# EAGLE design esp8266-3cell (EAGLE 8.5.2)
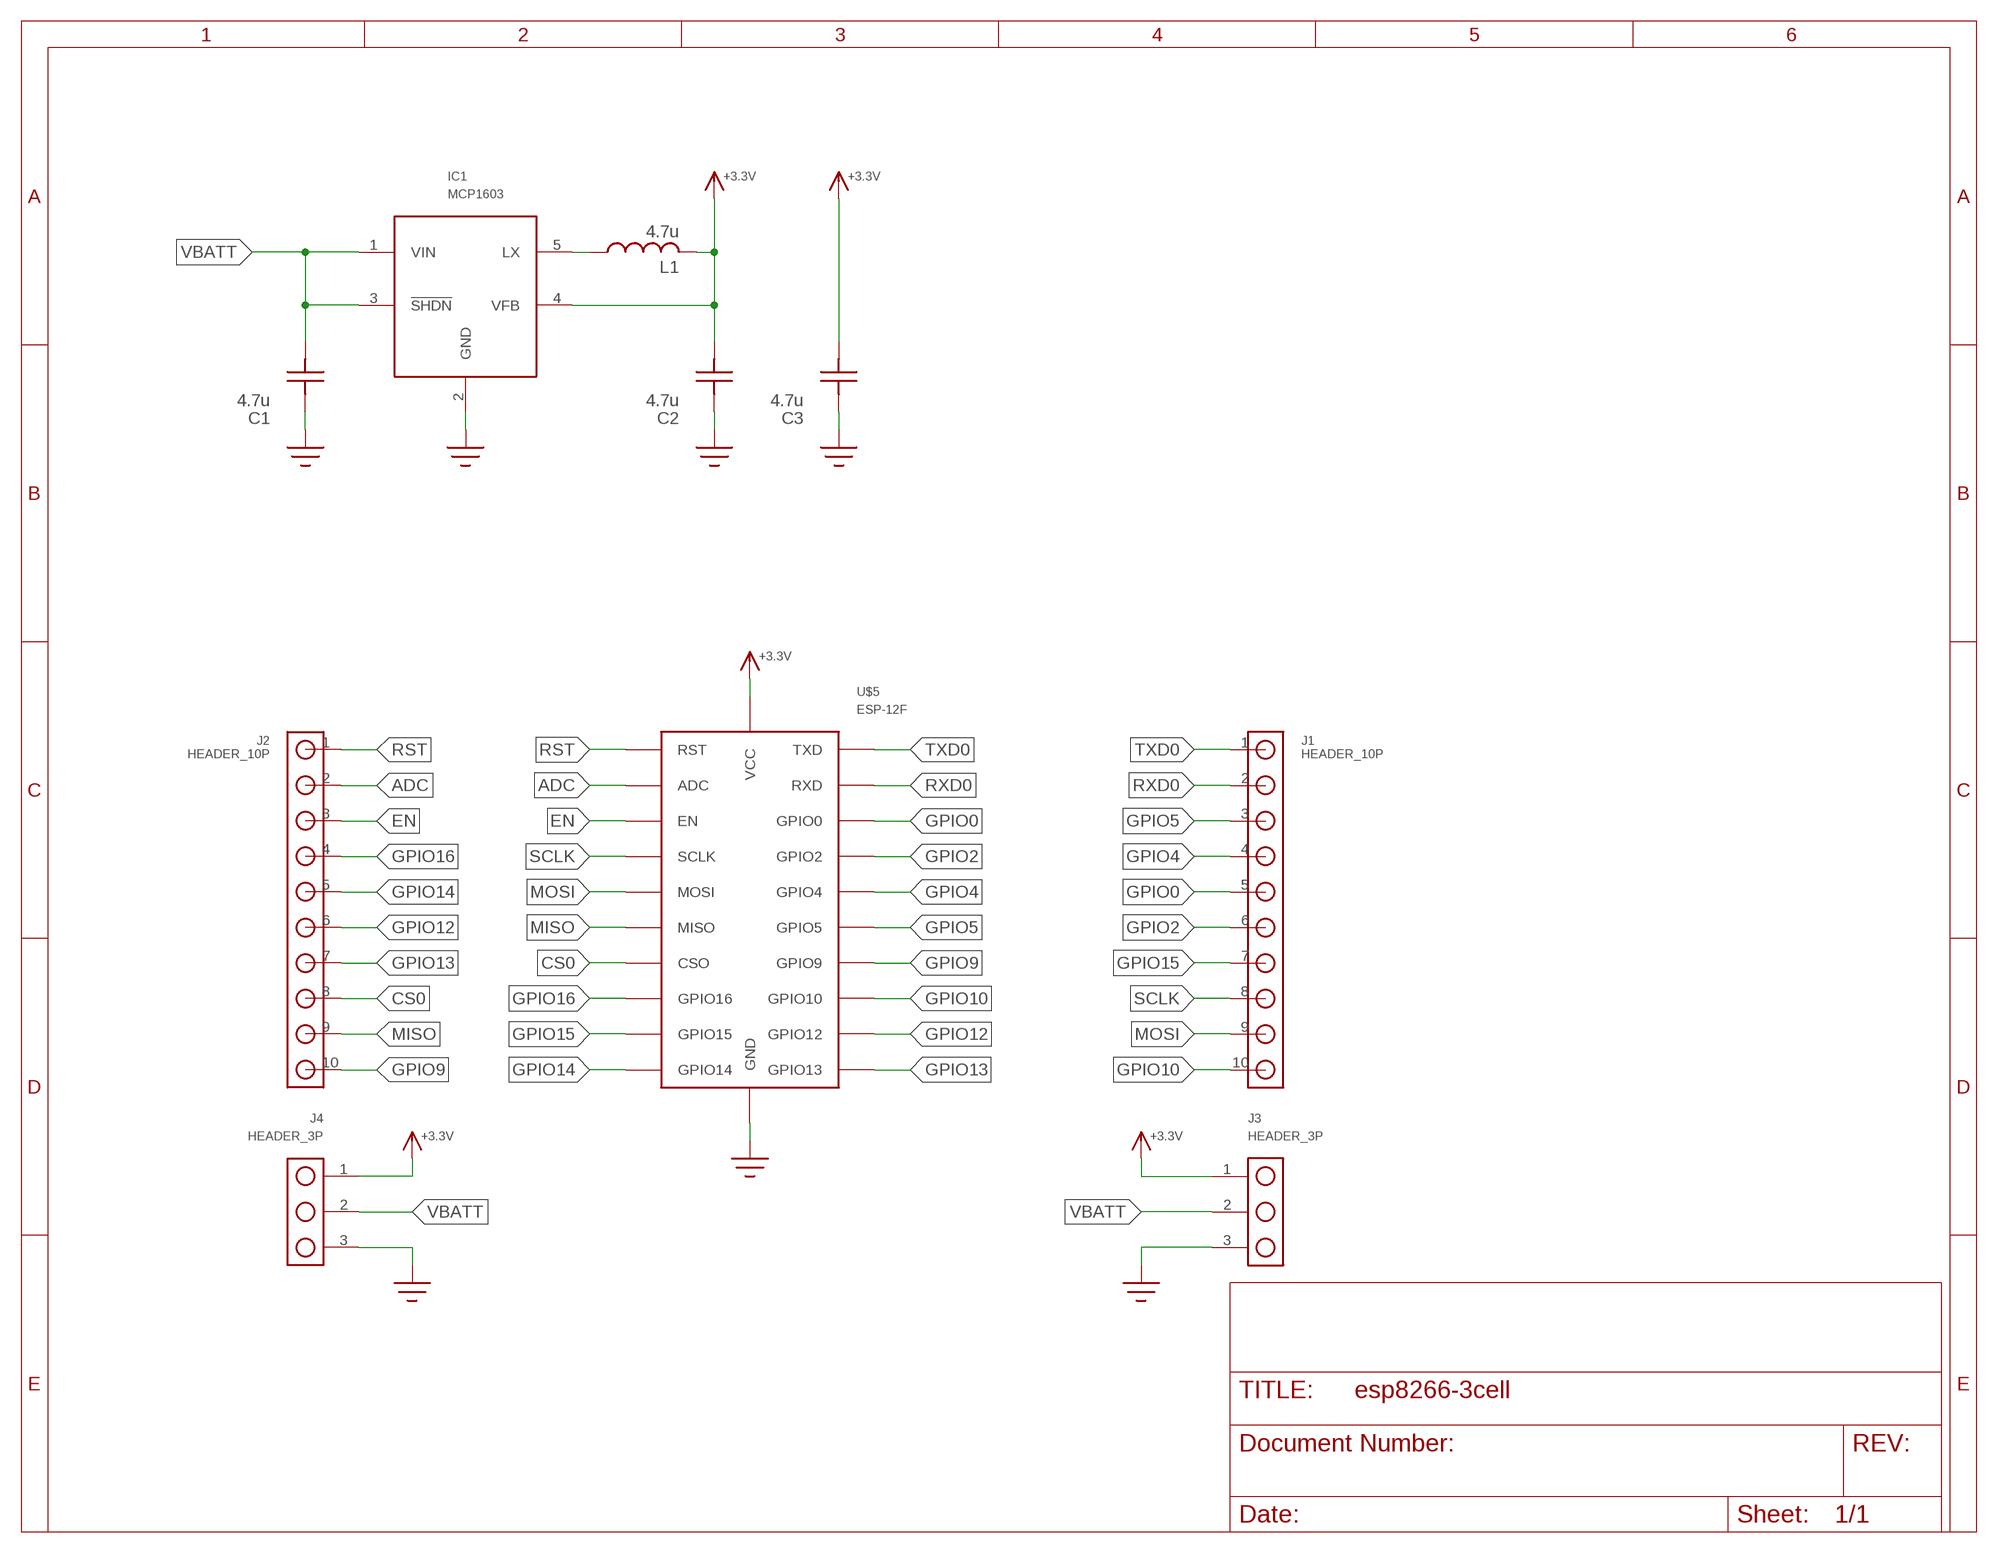
[diagram p0: schematic, sheet 1]

## Parts
C1  4.7u  C0805  [0805]
C2  4.7u  C0805  [0805]
C3  4.7u  C0805  [0805]
IC1  MCP1603  [SOT23-5]
J1  HEADER_10P  [HEADER_10P]
J2  HEADER_10P  [HEADER_10P]
J3  HEADER_3P  [HEADER_3P]
J4  HEADER_3P  [HEADER_3P]
L1  4.7u  L  [L24X24]
U$5  ESP-12F  [ESP-12F]

## Nets
+3.3V: C2.P$1 C3.P$1 IC1.4(VFB) J3.1 J4.1 L1.2 U$5.VCC
ADC: J2.2 U$5.ADC
CS0: J2.8 U$5.CSO
EN: J2.3 U$5.EN
GND: C1.P$2 C2.P$2 C3.P$2 IC1.2(GND) J3.3 J4.3 U$5.GND
GPIO0: J1.5 U$5.GPIO0
GPIO2: J1.6 U$5.GPIO2
GPIO4: J1.4 U$5.GPIO4
GPIO5: J1.3 U$5.GPIO5
GPIO9: J2.10 U$5.GPIO9
GPIO10: J1.10 U$5.GPIO10
GPIO12: J2.6 U$5.GPIO12
GPIO13: J2.7 U$5.GPIO13
GPIO14: J2.5 U$5.GPIO14
GPIO15: J1.7 U$5.GPIO15
GPIO16: J2.4 U$5.GPIO16
MISO: J2.9 U$5.MISO
MOSI: J1.9 U$5.MOSI
N$2: IC1.5(LX) L1.1
RST: J2.1 U$5.RST
RXD0: J1.2 U$5.RXD
SCLK: J1.8 U$5.SCLK
TXD0: J1.1 U$5.TXD
VBATT: C1.P$1 IC1.1(VIN) IC1.3(!SHDN!) J3.2 J4.2

## Library data of the parts
C1-C3 = esp8266-3cell:C
IC1 = esp8266-3cell:MCP1603
J1 J2 = esp8266-3cell:HEADER_10P
J3 J4 = esp8266-3cell:HEADER_3P
L1 = esp8266-3cell:L
U$5 = esp8266-3cell:ESP-12F

## Board
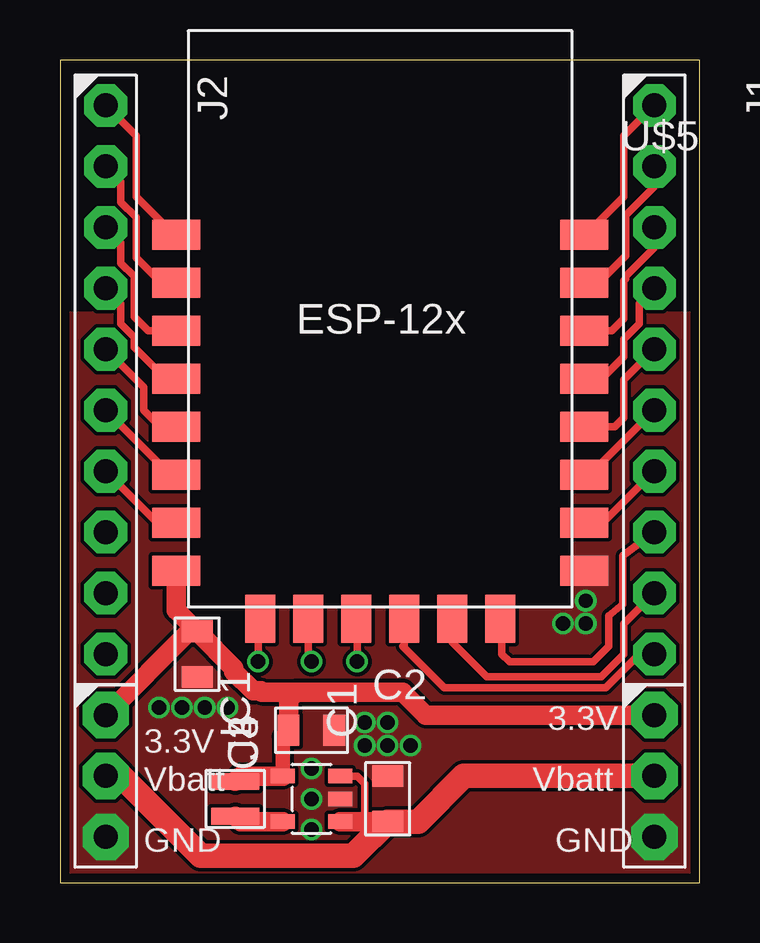
[diagram p1: board, top side]
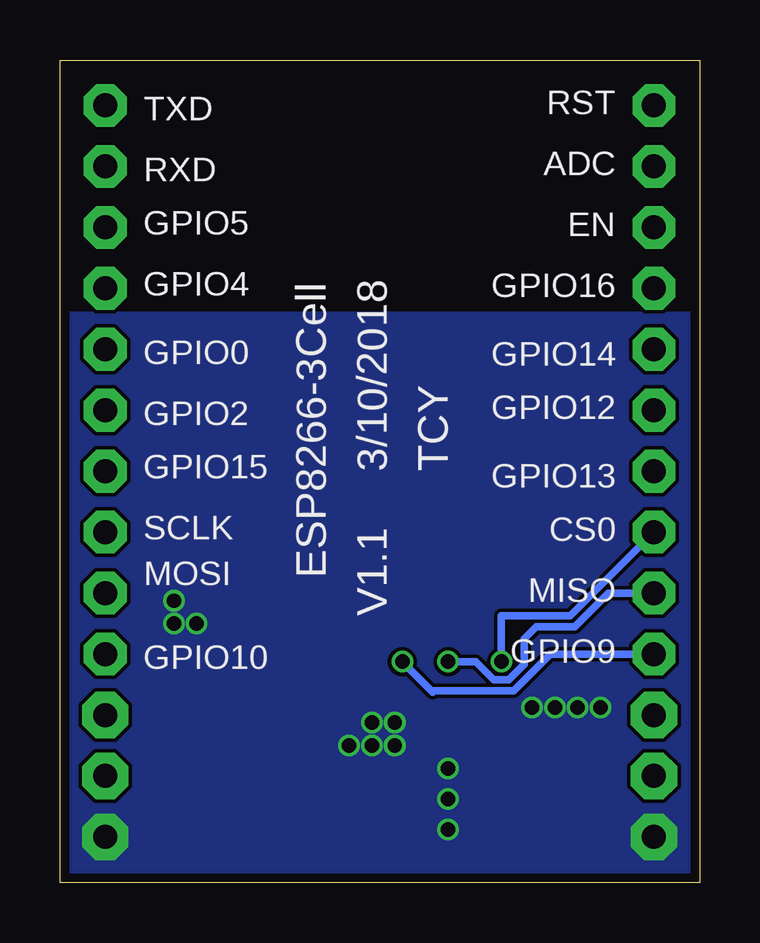
[diagram p2: board, bottom side, seen from below]

Size 26.65 x 34.28 mm. Coordinates in mm from the lower left corner, seen from the top.
Outline: 0,0 26.65,0 26.65,34.28 0,34.28 0,0
Copper layers (1*16): Top 0.035559375mm / dielectric 1.6mm / Bottom 0.035559375mm
Design rules "oshpark-2layer": minimum track width 6mil, minimum drill 10mil, track to track 6mil, track to pad 6mil, pad to pad 6mil, via to via 6mil, smd to smd 6mil, copper to edge 15mil, drill to drill 6mil, minimum pad ring 5mil, minimum via ring 5mil, stop-mask expansion 2.5mil, vias tented up to drill 0mil, thermal gap 10mil
tRestrict: area 5.4,11.4 to 21.3,27.6; area 0,23.8 to 26.7,34.3
bRestrict: area 0,23.8 to 26.7,34.3

### Footprints (pad centres in the part's own frame; a part is rotated, then mirrored left to right if it is on the bottom)
0805 = smd 0.9 x 1.3: P$1 -0.95,0; P$2 0.95,0
SOT23-5 = smd 0.6 x 1: 1 -0.95,-1.2; 2 0,-1.2; 3 0.95,-1.2; 4 0.95,1.2; 5 -0.95,1.2
HEADER_10P = drill 1 pad 1.778 octagon: 1 -11.43,0; 2 -8.89,0; 3 -6.35,0; 4 -3.81,0; 5 -1.27,0; 6 1.27,0; 7 3.81,0; 8 6.35,0; 9 8.89,0; 10 11.43,0
HEADER_3P = drill 1 pad 1.93 octagon: 1 -2.54,0; 2 0,0; 3 2.54,0
L24X24 = smd 0.7 x 2: 1 -0.725,0; 2 0.725,0
ESP-12F = smd 2 x 1.25: ADC -8.5,1.5; EN -8.5,-0.5; GND 8.5,-10.5; GPIO0 8.5,-4.5; GPIO2 8.5,-6.5; GPIO4 8.5,-2.5; GPIO5 8.5,-0.5; GPIO12 -8.5,-6.5; GPIO13 -8.5,-8.5; GPIO14 -8.5,-4.5; GPIO15 8.5,-8.5; GPIO16 -8.5,-2.5; RST -8.5,3.5; RXD 8.5,1.5; TXD 8.5,3.5; VCC -8.5,-10.5 | smd 1.25 x 2: CSO -5,-12.5; GPIO9 -1,-12.5; GPIO10 1,-12.5; MISO -3,-12.5; MOSI 3,-12.5; SCLK 5,-12.5

### Placement (x,y rotation side)
C1  13.65,3.49 90 top
C2  10.48,6.35 0 top
C3  5.71,9.53 270 top
IC1  10.48,3.49 90 top
J1  24.77,20.95 270 top
J2  1.91,20.95 270 top
J3  24.77,4.45 270 top
J4  1.91,4.45 270 top
L1  7.3,3.49 90 top
U$5  13.34,23.5 0 top

### Tracks (layer width: path | path; a pad name or v marks a point on that pad's centre or on a via)
+3.3V
  Top 0.61: C2.P$1 9.28,6.1 IC1.4
  Top 0.813: 9.84,7.94 14.29,7.94 15.24,6.99 J3.1 | 9.84,7.94 9.53,7.62 C2.P$1 | C3.P$1 7.25,8.94 7.25,8.79 8.04,7.99 8.36,7.99 8.41,7.94 9.84,7.94 | C3.P$1 4.83,11.36 U$5.VCC | J4.1 5.39,10.47 C3.P$1 | IC1.4 7.53,4.44 L1.2
ADC
  Top 0.305: J2.2 2.54,29.21 2.54,28.36 3.17,27.72 3.17,26.04 4.21,25 U$5.ADC
CS0  (via drill 0.6)
  Top 0.305: U$5.CSO 8.26,10.91 v8.26,9.21
  Bottom 0.305: J2.8 5.4,11.11 8.26,11.11 v8.26,9.21
EN
  Top 0.305: J2.3 2.54,26.67 2.54,25.82 3.1,25.26 3.1,23.57 3.67,23 U$5.EN
GND  (via drill 0.6)
  other vias: 5.08,7.3 6.03,7.3 12.7,5.71 12.7,6.67 6.99,7.3 4.13,7.3 13.65,5.71 13.65,6.67 14.61,5.71 21.91,11.75 21.91,10.79 20.95,10.79 10.48,3.49 10.48,4.76 10.48,2.22
  pour Top (rank 2, no thermals): 26.67,0 26.67,34.29 0,34.29 0,0
  pour Bottom (no thermals): 0,0 26.67,0 26.67,34.29 0,34.29
GPIO0
  Top 0.305: J1.5 23.5,20.95 23.5,19.37 23.12,19 U$5.GPIO0
GPIO2
  Top 0.305: J1.6 22.07,17 U$5.GPIO2
GPIO4
  Top 0.305: J1.4 24.13,24.13 24.13,23.28 23.5,22.64 23.5,21.91 22.58,21 U$5.GPIO4
GPIO5
  Top 0.305: J1.3 24.77,26.45 23.57,25.26 23.57,25.16 23.5,25.08 23.5,23.5 23,23 U$5.GPIO5
GPIO9  (via drill 0.6)
  Top 0.305: v12.38,9.21 12.38,10.95 U$5.GPIO9
  Bottom 0.305: v12.38,9.21 11.11,7.94 11.05,8 7.75,8 6.22,9.53 J2.10
GPIO10
  Top 0.305: J1.10 24.14,9.53 22.73,8.12 16.02,8.12 14.29,9.84 14.34,9.89 U$5.GPIO10
GPIO12
  Top 0.305: J2.6 4.59,17 U$5.GPIO12
GPIO13
  Top 0.305: J2.7 4.05,14.99 U$5.GPIO13
GPIO14
  Top 0.305: J2.5 3.49,20.64 3.49,19.68 4.18,19 U$5.GPIO14
GPIO15
  Top 0.305: J1.7 22.61,14.99 U$5.GPIO15
GPIO16
  Top 0.305: J2.4 2.54,24.13 2.54,23.28 3.1,22.72 3.1,22.3 4.45,20.95 4.49,21 U$5.GPIO16
MISO  (via drill 0.6)
  Top 0.305: v10.48,9.21 10.34,9.35 U$5.MISO
  Bottom 0.305: v10.48,9.21 9.32,9.21 8.57,8.45 7.94,8.45 7.3,9.09 7.3,10.16 6.81,10.65 5.21,10.65 3.8,12.06 J2.9
MOSI
  Top 0.305: U$5.MOSI 16.34,10.02 17.78,8.57 22.54,8.57 23.5,9.53 23.5,10.79 J1.9
N$2
  Top 0.813: IC1.5 7.53,2.54 L1.1
RST
  Top 0.305: J2.1 3.17,31.11 3.17,28.57 4.75,27 U$5.RST
RXD0
  Top 0.305: J1.2 24.77,28.99 23.57,27.8 23.57,26.11 22.45,25 U$5.RXD
SCLK
  Top 0.305: J1.8 23.46,13.62 23.46,11.61 22.86,11.11 22.86,9.84 22.23,9.21 18.73,9.21 18.4,9.53 18.4,10.04 U$5.SCLK
TXD0
  Top 0.305: J1.1 23.5,31.11 23.5,28.57 21.91,27 U$5.TXD
VBATT
  Top 0.305: IC1.3 12.38,4.44 12.7,4.13 12.7,3.87 12.7,3.86 12.7,2.54
  Top 0.61: IC1.1 11.75,2.47
  Top 0.813: C1.P$1 12.7,2.54 IC1.1
  Top 1.016: J3.2 16.83,4.45 14.92,2.54 C1.P$1 12.22,1.11 5.87,1.11 2.54,4.45 J4.2

### Text on the board
tPlace: ESP-12x | 3.3V | 3.3V | Vbatt | Vbatt | GND | GND
bPlace: RST | TXD | ADC | RXD | EN | GPIO5 | GPIO16 | GPIO4 | GPIO14 | GPIO0 | GPIO12 | GPIO2 | GPIO13 | TCY | 3/10/2018 | GPIO15 | CS0 | SCLK | MISO | ESP8266-3Cell | MOSI | V1.1 | GPIO9 | GPIO10